# Altium schematic sheet 07_ESP-12F_Circuit.SchDoc
size A; SheetNumber: 8; SheetTotal: 8
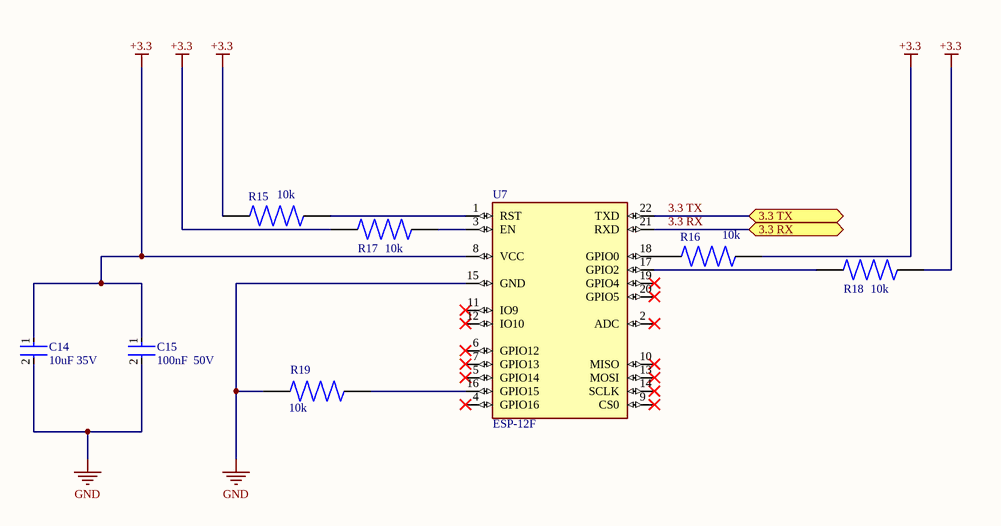
[diagram p0: 07_ESP-12F_Circuit.SchDoc]

## Parts
C14  10uF 35V  [FP-GRM21B-0_2-e0_2_0_7-IPC_B]
C15  100nF  50V  [FP-0805-L_2_01_0_2-W_1_25-IPC_C]
R15  10k  [RESC3115X65N]
R16  10k  [RESC3115X65N]
R17  10k  [RESC3115X65N]
R18  10k  [RESC3115X65N]
R19  10k  [RESC3115X65N]
U7  ESP-12F  [ESP-12F]

## Ports
3.3 RX (bidir, see 00_Overview[4C], 06_Logic_Level_Shifters[3D]), 3.3 TX (bidir, see 00_Overview[4C], 06_Logic_Level_Shifters[1D])

## Nets
+3.3: C14.1 C15.1 R15.1 R16.2 R17.1 R18.2 U7.8(VCC)
GND: C14.2 C15.2 R19.1 U7.15(GND)
3.3 RX: U7.21(RXD) ; port 3.3 RX
3.3 TX: U7.22(TXD) ; port 3.3 TX
NetR15_2: R15.2 U7.1(RST)
NetR16_1: R16.1 U7.18(GPIO0)
NetR17_2: R17.2 U7.3(EN)
NetR18_1: R18.1 U7.17(GPIO2)
NetR19_2: R19.2 U7.16(GPIO15)

Not connected (* = marked no-connect by the designer): U7 2(ADC)* 4(GPIO16)* 5(GPIO14)* 6(GPIO12)* 7(GPIO13)* 9(CS0)* 10(MISO)* 11(IO9)* 12(IO10)* 13(MOSI)* 14(SCLK)* 19(GPIO4)* 20(GPIO5)*

## Library data of the parts
C14 = CMP-06035-010759-1: Chip Multilayer Ceramic Capacitors for General Purpose, 0805, 10uF, X5R, 15%, 20%, 35V; Length: 0.079inch; Packaging: Tape and Reel; Weight: 0.000335oz; Height: 1.25mm; Max Operating Temperature: 85°C; Thickness: 0.057inch; Case Code (Metric): 2012; Voltage Rating: 35V; Voltage Rating (DC): 35V; Mount: Surface Mount; Case Code (Imperial): 0805; Width: 0.049inch; Package Quantity: 3000; Tolerance: 20%; Capacitance: 10uF; Min Operating Temperature: -55°C; Case/Package: 0805; Termination: SMD/SMT; Dielectric: X5R
C15 = CMP-2000-05016-2: General Purpose Ceramic Capacitor, 0805, 100nF, 10%, X7R, 0.15, 50V; Dissipation Factor: 2.5%; Insulation Resistance: 100GR; Voltage Rating (DC): 50V; Package Quantity: 4000; Tolerance: 10%; Voltage Rating: 50V; Dielectric: X7R; Case/Package: 0805; Lead Free: Lead Free; Dielectric Material: Ceramic; Thickness: 0.037inch; Weight: 0.001411oz; Max Operating Temperature: 125°C; REACH SVHC: No SVHC; Mount: Surface Mount; RoHS Compliant: Yes; Depth: 1.25mm; Height: 0.5mm; Case Code (Metric): 2012; Length: 2mm; Termination: Standard; Case Code (Imperial): 0805; Number of Pins: 2; Voltage: 50V; Radiation Hardening: No; Min Operating Temperature: -55°C; Capacitance: 100nF; Width: 1.2mm; Series: MLCC X7R; Packaging: Cut Tape
R15-R19 = 1206W4F1002T5E: 10K Ohm 1/4W Thick Film Resistor 1206 Chip - Surface Mount; MF: Uni-Royal; SnapEDA_Link: https://www.snapeda.com/parts/1206W4F1002T5E/Uni-Royal/view-part/?ref=snap; Package: 1206-2 ROYAL; Value: *; MP: 1206W4F1002T5E; Check_prices: https://www.snapeda.com/parts/1206W4F1002T5E/Uni-Royal/view-part/?ref=eda
U7 = ESP-12F: WiFi Module; MF: AI-Thinker; SnapEDA_Link: https://www.snapeda.com/parts/ESP-12F/AI-Thinker/view-part/?ref=snap; Package: Package; Value: *; MP: ESP-12F; Check_prices: https://www.snapeda.com/parts/ESP-12F/AI-Thinker/view-part/?ref=eda